# Altium schematic sheet IC common.SchDoc
size A3
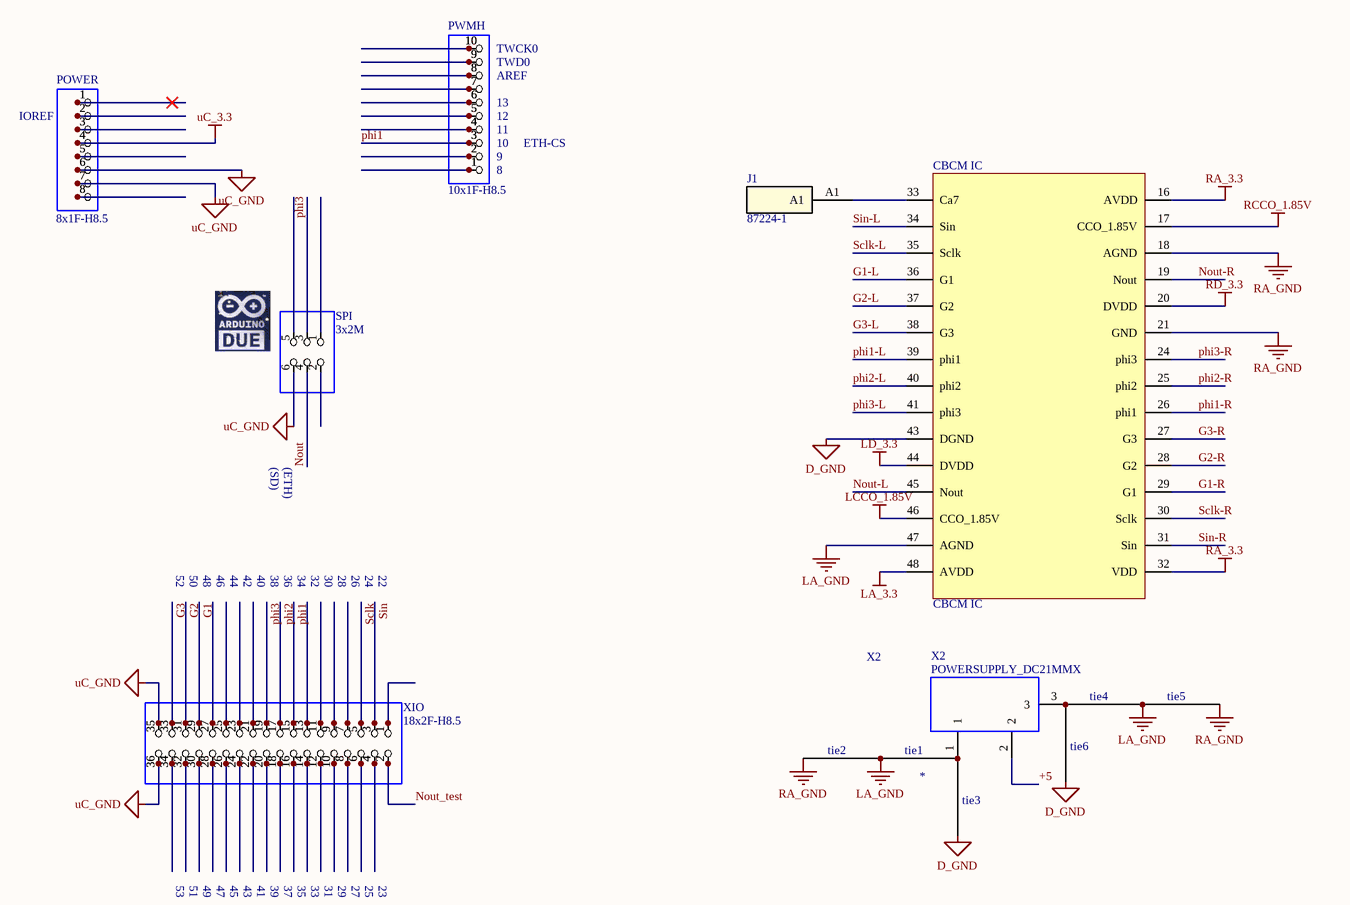
[diagram p0: IC common.SchDoc]

## Parts
CBCM_IC  CBCM IC  [PGA85x11]
J1  87224-1  [87224-1]
POWER  8x1F-H8.5  [1X08]
PWMH  10x1F-H8.5  [1X10]
SPI  3x2M  [2X03]
tie1  Net Tie  [net_tie]  (value not drawn)  (net tie, no BOM)
tie2  Net Tie  [net_tie]  (value not drawn)  (net tie, no BOM)
tie3  Net Tie  [net_tie]  (value not drawn)  (net tie, no BOM)
tie4  Net Tie  [net_tie]  (value not drawn)  (net tie, no BOM)
tie5  Net Tie  [net_tie]  (value not drawn)  (net tie, no BOM)
tie6  Net Tie  [net_tie]  (value not drawn)  (net tie, no BOM)
X2  *  [POWERSUPPLY_DC-21MM]
XIO  18x2F-H8.5  [2X18]

## Nets
D_GND: CBCM_IC.43(DGND) tie3.0 tie6.0
LA_3.3: CBCM_IC.48(AVDD)
LA_GND: CBCM_IC.47(AGND) tie1.0 tie2.1 tie4.1 tie5.0
LCCO_1.85V: CBCM_IC.46(CCO_1.85V)
LD_3.3: CBCM_IC.44(DVDD)
RA_3.3: CBCM_IC.16(AVDD) CBCM_IC.32(VDD)
RA_GND: CBCM_IC.18(AGND) CBCM_IC.21(GND) tie2.0 tie5.1
RCCO_1.85V: CBCM_IC.17(CCO_1.85V)
RD_3.3: CBCM_IC.20(DVDD)
uC_3.3: POWER.4
uC_GND: POWER.6 POWER.7 SPI.6 XIO.35 XIO.36
+5: X2.2
G1: XIO.29
G1-L: CBCM_IC.36(G1)
G1-R: CBCM_IC.29(G1)
G2: XIO.31
G2-L: CBCM_IC.37(G2)
G2-R: CBCM_IC.28(G2)
G3: XIO.33
G3-L: CBCM_IC.38(G3)
G3-R: CBCM_IC.27(G3)
Nout: SPI.4
Nout-L: CBCM_IC.45(Nout)
Nout-R: CBCM_IC.19(Nout)
Nout_test: XIO.2
phi1: PWMH.3 XIO.15
phi1-L: CBCM_IC.39(phi1)
phi1-R: CBCM_IC.26(phi1)
phi2: XIO.17
phi2-L: CBCM_IC.40(phi2)
phi2-R: CBCM_IC.25(phi2)
phi3: SPI.3 XIO.19
phi3-L: CBCM_IC.41(phi3)
phi3-R: CBCM_IC.24(phi3)
Sclk: XIO.5
Sclk-L: CBCM_IC.35(Sclk)
Sclk-R: CBCM_IC.30(Sclk)
Sin: XIO.3
Sin-L: CBCM_IC.34(Sin)
Sin-R: CBCM_IC.31(Sin)
NetCBCM_IC_33: CBCM_IC.33(Ca7) J1.A1
Nettie1_1: tie1.1 tie3.1 X2.1
Nettie4_0: tie4.0 tie6.1 X2.3

Not connected (* = marked no-connect by the designer): POWER 1* 2 3 5 8; PWMH 1 2 4 5 6 7 8 9 10; SPI 1 2 5; XIO 1 4 6 7 8 9 10 11 12 13 14 16 18 20 21 22 23 24 25 26 27 28 30 32 34

## Notes on the sheet
- (near PWMH) TWCK0
- (near PWMH) TWD0
- (near POWER) IOREF
- (near PWMH) 11
- (near PWMH) 12
- (near PWMH) 13
- (near PWMH) AREF
- (near PWMH) 8
- (near PWMH) 9
- (near PWMH) 10
- (near PWMH) ETH-CS
- (SD)
- (ETH)
- 52
- 50
- 48
- 46
- 44
- 42
- 40
- 38
- 36
- 34
- 32
- 30
- 28
- 26
- 24
- 22
- 53
- 51
- 49
- 47
- 45
- 43
- 41
- 39
- 37
- 35
- 33
- 31
- 29
- 27
- 25
- 23

## Library data of the parts
CBCM_IC = CBCM IC: pin to pad: 16>H1 17>H2 18>J1 19>K1 20>J2 21>L1 24>L2 25>L3 26>K4 27>L4 28>J5 29>K5 30>L5 31>K6 32>J6 33>J7 34>L7 35>K7 36>L6 37>L8 38>K8 39>L9 40>L10 41>K9 43>K10 44>J10 45>K11 46>J11 47>H10 48>H11
J1 = 87224-1: Imported; pin to pad: A1>1; Vendor: TE Connectivity; Built_By: EMA_UL_Team; C: Copyright (C) 2015 Accelerated Designs. All rights reserved; Manufacturer_Part_Number: 87224-1; RefDes: RefDes; Type: DEV; Value: Value
POWER = PINHD-1X8
PWMH = PINHD-1X10
SPI = PINHD-2X3
X2 = POWERSUPPLY_DC21MMX
XIO = PINHD-2X18